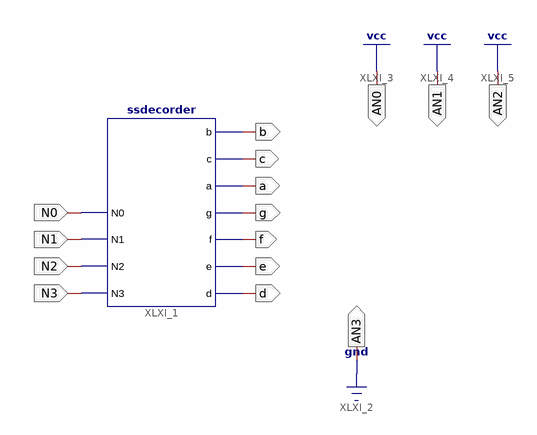
[diagram p0: schematic sheet 1]
// Xilinx ISE schematic testbench.sch (spartan3e) as structural Verilog: 1 symbols, 15 ports
module testbench (
  input  N0,
  input  N1,
  input  N2,
  input  N3,
  output b,
  output c,
  output a,
  output g,
  output f,
  output e,
  output d,
  output AN0,
  output AN3,
  output AN1,
  output AN2
);

  ssdecorder XLXI_1 (.b(b), .c(c), .a(a), .N0(N0), .N1(N1), .N2(N2), .N3(N3), .g(g), .f(f), .e(e), .d(d));

  assign AN0 = 1'b1;
  assign AN1 = 1'b1;
  assign AN2 = 1'b1;
  assign AN3 = 1'b0;
endmodule
